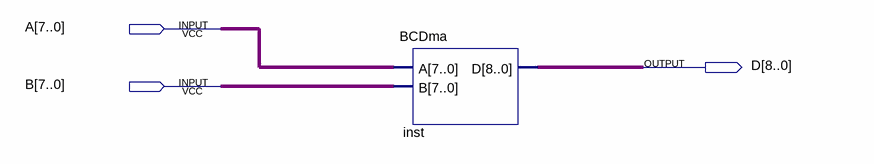
[diagram p0: schematic sheet]
// Quartus schematic Block1.bdf as structural Verilog: 1 symbols, 3 pins
module Block1 (
  input  [7:0] A,
  input  [7:0] B,
  output [8:0] D
);

  BCDma inst (.A(A), .B(B), .D(D));
endmodule
